# Altium project Sensor de temperatura Ej4.PrjPcb
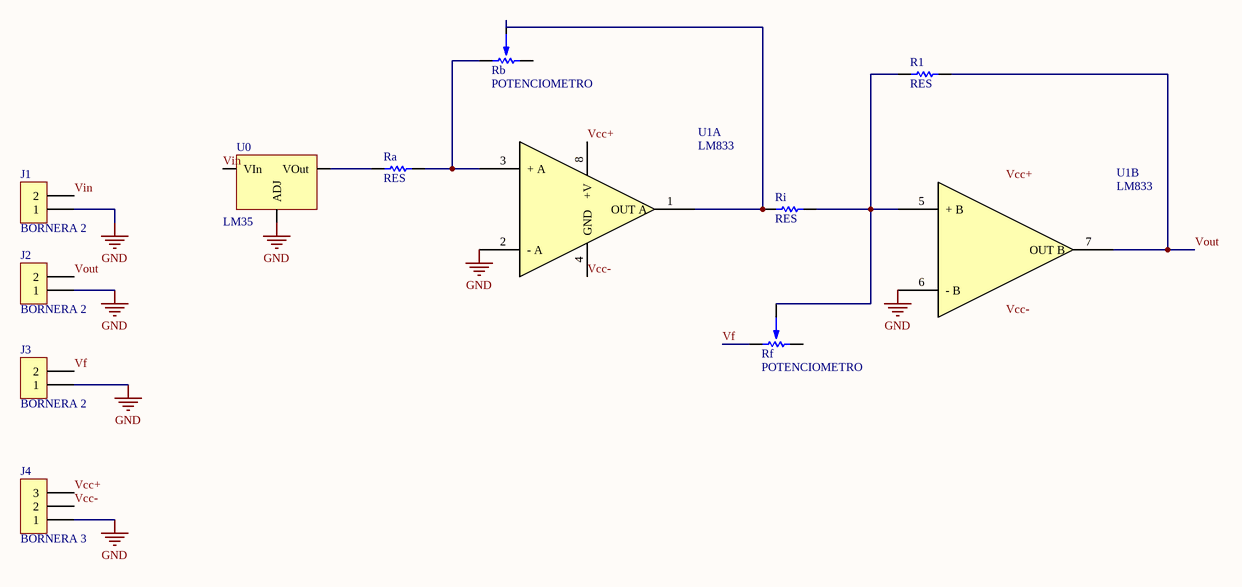
[diagram p0: Circuito de Aplicacion Ej4.SchDoc]
1 sheet, 11 parts. Net scope: global (net labels, ports and power ports of the same name join across sheets).
Board file: Circuito de aplicación Ej4.PcbDoc

## Sheet Circuito de Aplicacion Ej4.SchDoc
size A4

### Parts
J1  BORNERA 2  [BORNERA2]
J2  BORNERA 2  [BORNERA2]
J3  BORNERA 2  [BORNERA2]
J4  BORNERA 3  [BORNERA3]
R1  RES  [RES400]
Ra  RES  [RES400]
Rb  POTENCIOMETRO  [POTENCIOMETRO]
Rf  POTENCIOMETRO  [POTENCIOMETRO]
Ri  RES  [RES400]
U0  LM35  [TO-220 H - DISIPADOR]
U1  LM833  [DIP8]  (parts A,B of 2)

### Nets
GND: J1.1 J2.1 J3.1 J4.1 U0.1(ADJ) U1.2(-_A) U1.6(-_B)
Vcc+: J4.3 U1.8(+V)
Vcc-: J4.2 U1.4(GND)
Vf: J3.2 Rf.1
Vin: J1.2 U0.3(VIn)
Vout: J2.2 R1.2 U1.7(OUT_B)
NetR1_1: R1.1 Rf.2 Ri.2 U1.5(+_B)
NetRa_1: Ra.1 U0.2(VOut)
NetRa_2: Ra.2 Rb.1 U1.3(+_A)
NetRb_2: Rb.2 Ri.1 U1.1(OUT_A)

Not connected (* = marked no-connect by the designer): Rb 3; Rf 3

### Notes on the sheet
- Labels drawn without touching a wire or pin: Vcc+, Vcc-

### Library data of the parts
U0 = LM317: IC REG ADJ 1.5A 3 TERM TO-220
U1 = LM833: Dual Audio Operational Amplifier